# EAGLE board InkTime (EAGLE 9.7.0)
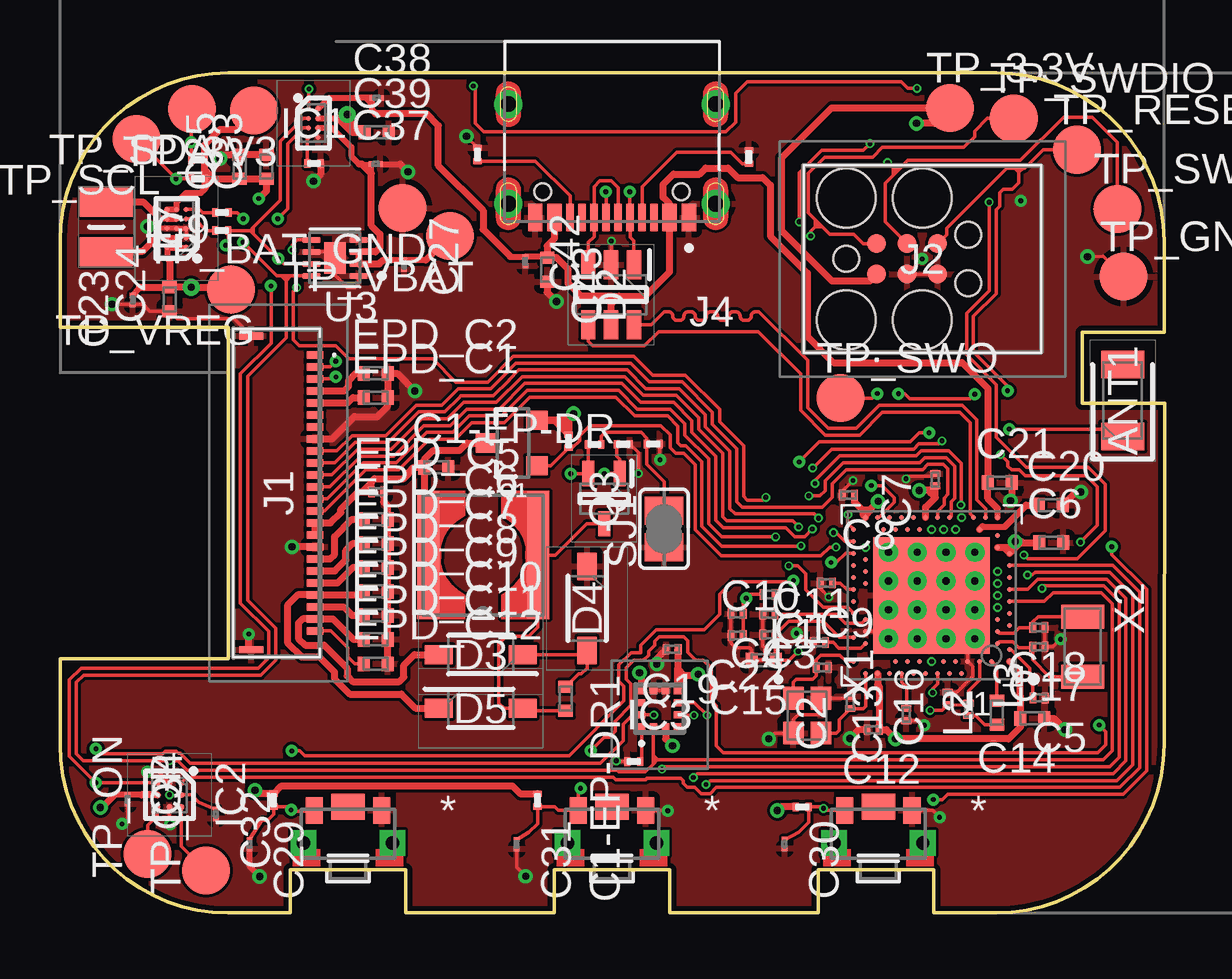
[diagram p1: board, top side]
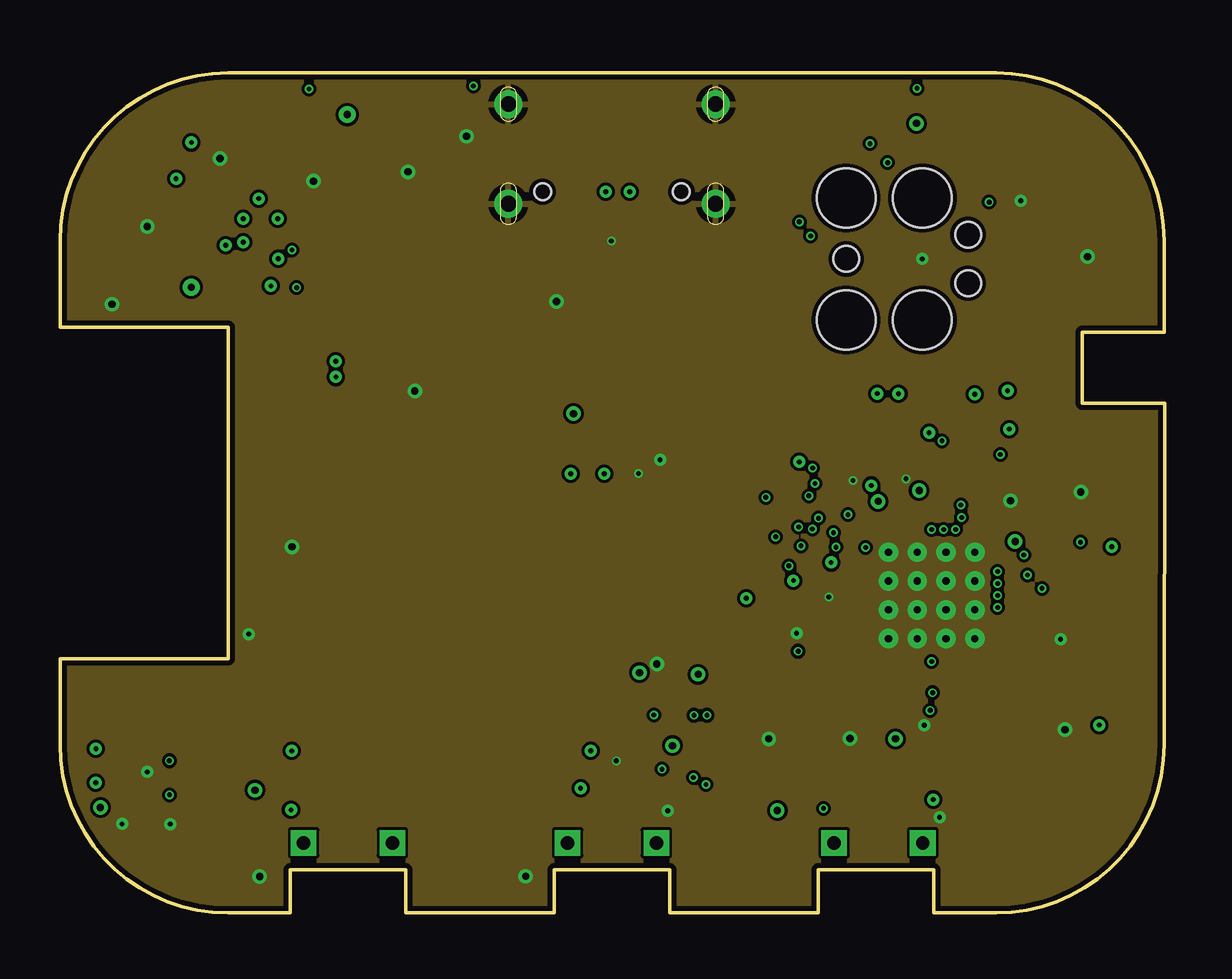
[diagram p2: board, inner layer Route2]
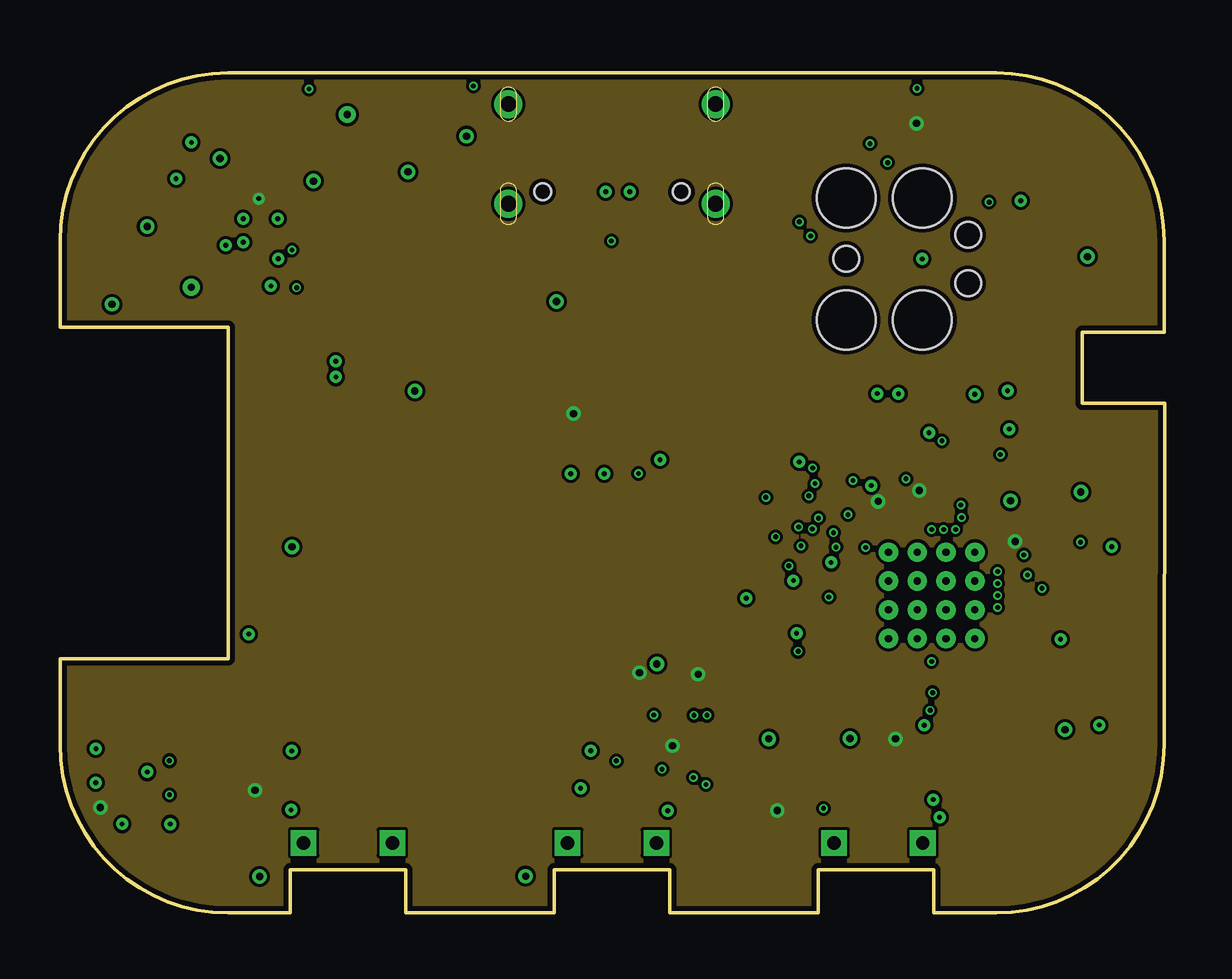
[diagram p3: board, inner layer Route15]
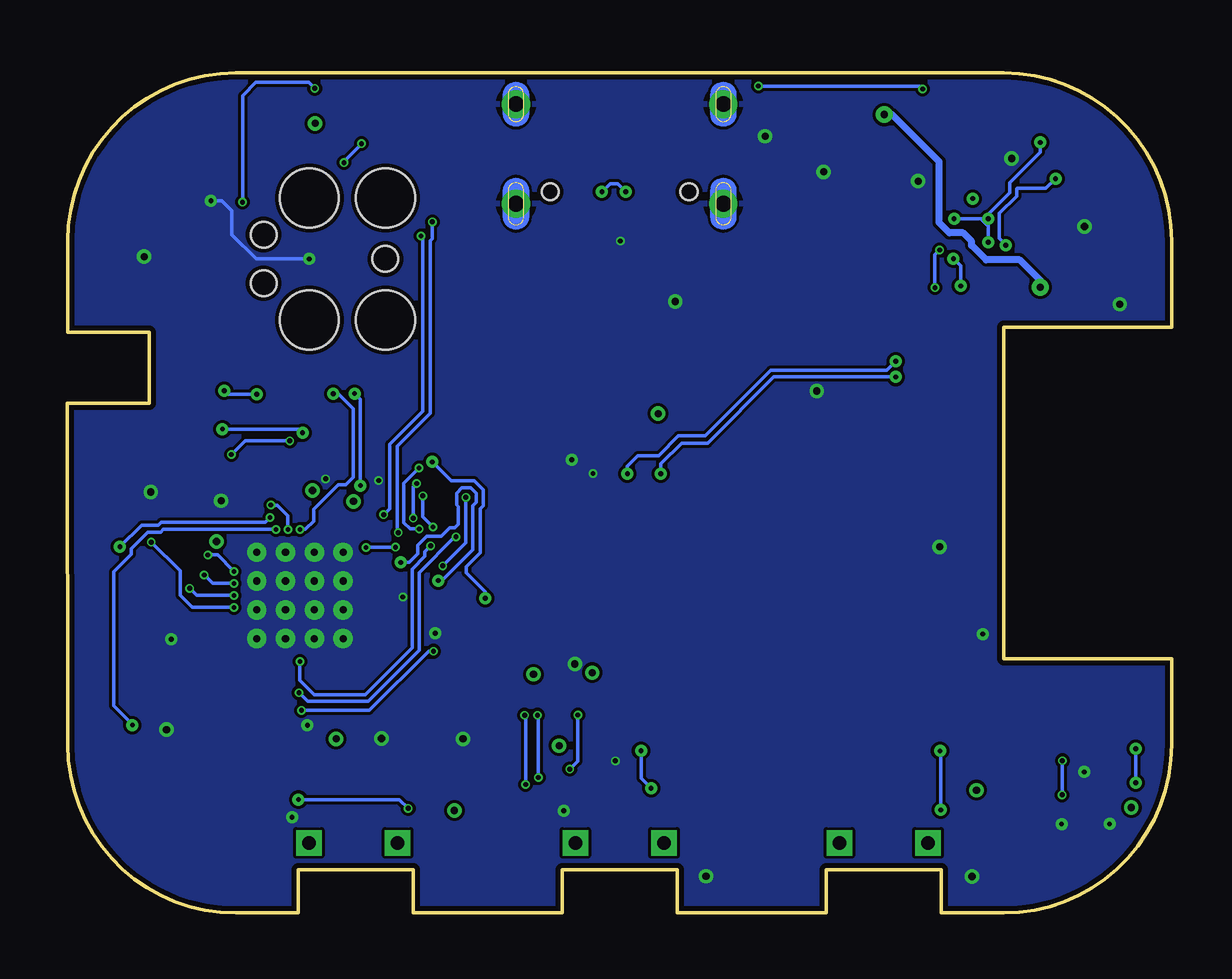
[diagram p4: board, bottom side, seen from below]

Size 46.02 x 35 mm. Coordinates in mm from the lower left corner, seen from the top.
Outline: 39,0 36.4,0 36.4,1.8 31.6,1.8 31.6,0 25.4,0 25.4,1.8 20.6,1.8 20.6,0 14.4,0 14.4,1.8 9.6,1.8 9.6,0 7,0 arc-90 0,7 0,10.6 7,10.6 7,24.4 0,24.4 0,28 arc-90 7,35 39,35 arc-90 46,28 46,24.19 42.59,24.19 42.59,21.24 46.02,21.24 46,7 arc-90 39,0
Copper layers (1+2*15+16): Top 0.035mm / dielectric 1.6mm / Route2 0.035mm / dielectric 0.15mm / Route15 0.035mm / dielectric 0.2mm / Bottom 0.035mm
Design rules "jlcpcb-2layers.dru *": minimum track width 5mil, minimum drill 0.2mm, track to track 5mil, track to pad 5mil, pad to pad 5mil, via to via 5mil, smd to smd 5mil, copper to edge 0.2mm, drill to drill 6mil, minimum pad ring 10mil, minimum via ring 3mil, stop-mask expansion 4mil, vias tented up to drill 999mm, thermal gap 10mil

## Footprints (pad centres in the part's own frame; a part is rotated, then mirrored left to right if it is on the bottom)
2450AT18B100E_ANTC3216X140N = smd 1.15 x 1.8: 1 -1.5,0; 2 1.5,0
NORDIC_NRF_3_RESC0201_L = smd 0.28 x 0.43: 1 -0.255,0; 2 0.255,0
NORDIC_NRF_3_RESC0402_L = smd 0.5 x 0.6: 1 -0.5,0; 2 0.5,0
GRM011R60J152KE01L_2_CAPC0201X13N = smd 0.22 x 0.23: 1 -0.185,0; 2 0.185,0
ESP32_C6_LIBRARY_3_SOT95P280X145-6N = smd 1.2 x 0.6: 1 -1.25,0.95; 2 -1.25,0; 3 -1.25,-0.95; 4 1.25,-0.95; 5 1.25,0; 6 1.25,0.95
ESP32_C6_LIBRARY_5_SOD3716X135N = smd 1.15 x 0.8: 1 -1.75,0; 2 1.75,0
BQ25180YBGR_BGA8C40P2X4_100X155X50 = smd 0.2 x 0.2: A1 -0.2,0.6; A2 0.2,0.6; B1 -0.2,0.2; B2 0.2,0.2; C1 -0.2,-0.2; C2 0.2,-0.2; D1 -0.2,-0.6; D2 0.2,-0.6
DRV2605YZFR_BGA9C50P3X3_144X144X62 = smd 0.25 x 0.25: A1 -0.5,0.5; A2 0,0.5; A3 0.5,0.5; B1 -0.5,0; B2 0,0; B3 0.5,0; C1 -0.5,-0.5; C2 0,-0.5; C3 0.5,-0.5
BMA423_BMA423 = smd 0.3 x 0.35: 1 -0.75,-0.775; 2 -0.25,-0.775; 3 0.25,-0.775; 4 0.75,-0.775; 7 0.75,0.775; 8 0.25,0.775; 9 -0.25,0.775; 10 -0.75,0.775 | smd 0.35 x 0.3: 5 0.775,-0.25; 6 0.775,0.25; 11 -0.775,0.25; 12 -0.775,-0.25
RT6160AWSC_BGA15C40P3X5_140X230X60 = smd 0.216 x 0.216: A1 -0.4,0.8; A2 0,0.8; A3 0.4,0.8; B1 -0.4,0.4; B2 0,0.4; B3 0.4,0.4; C1 -0.4,0; C2 0,0; C3 0.4,0; D1 -0.4,-0.4; D2 0,-0.4; D3 0.4,-0.4; E1 -0.4,-0.8; E2 0,-0.8; E3 0.4,-0.8
503480-2400_5034802400 = smd 0.3 x 0.7: 1 -5.75,1.525; 2 -5.25,1.525; 3 -4.75,1.525; 4 -4.25,1.525; 5 -3.75,1.525; 6 -3.25,1.525; 7 -2.75,1.525; 8 -2.25,1.525; 9 -1.75,1.525; 10 -1.25,1.525; 11 -0.75,1.525; 12 -0.25,1.525; 13 0.25,1.525; 14 0.75,1.525; 15 1.25,1.525; 16 1.75,1.525; 17 2.25,1.525; 18 2.75,1.525; 19 3.25,1.525; 20 3.75,1.525; 21 4.25,1.525; 22 4.75,1.525; 23 5.25,1.525; 24 5.75,1.525 | smd 0.3 x 1: MP1 -6.54,-1.125; MP2 6.54,-1.125
TC2030-IDC_TC2030IDC = smd 0.783 x 0.783: 1 -0.953,-0.635; 2 -0.953,0.635; 3 0.317,-0.635; 4 0.317,0.635; 5 1.588,-0.635; 6 1.588,0.635 | hole 2.451: -2.223,-2.54; -2.223,2.54; 0.952,-2.54; 0.952,2.54 | hole 1.067: -2.223,0; 2.857,-1.016; 2.857,1.016
KH-TYPE-C-16P_KINGHELM_KH-TYPE-C-16P = smd 0.6 x 1.15: A1_B12 -3.2,4.725; A4_B9 -2.4,4.725; A9_B4 2.4,4.725; A12_B1 3.2,4.725 | smd 0.3 x 1.15: A5 -1.25,4.725; A6 -0.25,4.725; A7 0.25,4.725; A8 1.25,4.725; B5 1.75,4.725; B6 0.75,4.725; B7 -0.75,4.725; B8 -1.75,4.725 | drill 0.65 pad 1.05: SH1 -4.32,0; SH2 4.32,0; SH3 -4.32,4.15; SH4 4.32,4.15 | hole 0.7: -2.89,3.65; 2.89,3.65
NORDIC_NRF_2_RESC0201_L = smd 0.28 x 0.43: 1 -0.255,0; 2 0.255,0
NORDIC_NRF_2_RESC0402_L = smd 0.5 x 0.6: 1 -0.5,0; 2 0.5,0
ESP32_C6_LIBRARY_2_IND_4828-WE-TPC_WRE = smd 0.9 x 5.3: 1 -2.286,0; 2 2.286,0
MLP2016SR47MT0S1_INDC2016X100N = smd 1.2 x 2.2: 1 -1.028,0; 2 1.028,0
ESP32_C6_LIBRARY_4_ESP32_C6_LIBRARY_4_ESP32_C6_LIBRARY_4_ESP32_C6_LIBRARY_4_ESP32_WROVER_SPARKFUN-DISCRETESEMI_SOT23-3 = smd 0.8 x 0.9: 1 -0.95,-1; 2 0.95,-1; 3 0,1.1
ESP32_C6_LIBRARY_6_SOT65P210X110-3N = smd 1.05 x 0.5: 1 -1.05,0.65; 2 -1.05,-0.65; 3 1.05,0
CPF0201D7K68C1_0201 = smd 0.35 x 0.25: 1 0,0.275; 2 0,-0.275
ERA-1AEB3401C_0201 = smd 0.35 x 0.25: 1 0,0.275; 2 0,-0.275
ESP32_C6_LIBRARY_7_JUMPER_SJ = smd 1.168 x 1.6: 1 -0.762,0; 2 0.762,0
2025-10-22_07-23-44_LIBRARY_SW_EVP-AKE31A_PAN = smd 0.711 x 1.092: 1 -1.4,-0.972; 2 1.4,-0.972 | drill 0.559 pad 0.914 square: 3 -1.848,0.381; 4 1.848,0.381 | smd 1.397 x 1.092: 5 0,-1.124
HECTOR_WATCH_1_TP20R = smd 2 x 2: TP 0,0
NORDIC_NRF_4_AQFN50P700X700X85_HS-74N = smd 4.85 x 4.85: P$74 0,0 | drill 0.3 pad 0.6: P$75 -1.8,1.8; P$76 -0.6,1.8; P$77 0.6,1.8; P$78 1.8,1.8; P$79 -1.8,0.6; P$80 -0.6,0.6; P$81 0.6,0.6; P$82 1.8,0.6; P$83 -1.8,-0.6; P$84 -0.6,-0.6; P$85 0.6,-0.6; P$86 1.8,-0.6; P$87 -1.8,-1.8; P$88 -0.6,-1.8; P$89 0.6,-1.8; P$90 1.8,-1.8 | smd 0.2 x 0.2: P$A8 -1.25,3.25; P$A10 -0.75,3.25; P$A12 -0.25,3.25; P$A14 0.25,3.25; P$A16 0.75,3.25; P$A18 1.25,3.25; P$A20 1.75,3.25; P$A22 2.25,3.25; P$A23 2.75,3.25; P$AA24 3.25,-2.25; P$AB2 -2.75,-2.5; P$AC5 -2,-2.75; P$AC9 -1,-2.75; P$AC11 -0.5,-2.75; P$AC13 0,-2.75; P$AC15 0.5,-2.75; P$AC17 1,-2.75; P$AC19 1.5,-2.75; P$AC21 2,-2.75; P$AC24 3.25,-2.75; P$AD2 -2.75,-3.25; P$AD4 -2.25,-3.25; P$AD6 -1.75,-3.25; P$AD8 -1.25,-3.25; P$AD10 -0.75,-3.25; P$AD12 -0.25,-3.25; P$AD14 0.25,-3.25; P$AD16 0.75,-3.25; P$AD18 1.25,-3.25; P$AD20 1.75,-3.25; P$AD22 2.25,-3.25; P$AD23 2.75,-3.25; P$B1 -3.25,2.75; P$B3 -2.5,2.75; P$B5 -2,2.75; P$B7 -1.5,2.75; P$B9 -1,2.75; P$B11 -0.5,2.75; P$B13 0,2.75; P$B15 0.5,2.75; P$B17 1,2.75; P$B19 1.5,2.75; P$B24 3.25,2.75; P$C1 -3.25,2.25; P$D2 -2.75,2; P$D23 2.75,2; P$E24 3.25,1.75; P$F2 -2.75,1.5; P$F23 2.75,1.5; P$G1 -3.25,1.25; P$H2 -2.75,1; P$H23 2.75,1; P$J1 -3.25,0.75; P$J24 3.25,0.75; P$K2 -2.75,0.5; P$L1 -3.25,0.25; P$L24 3.25,0.25; P$M2 -2.75,0; P$N1 -3.25,-0.25; P$N24 3.25,-0.25; P$P2 -2.75,-0.5; P$P23 2.75,-0.5; P$R1 -3.25,-0.75; P$R24 3.25,-0.75; P$T2 -2.75,-1; P$T23 2.75,-1; P$U1 -3.25,-1.25; P$U24 3.25,-1.25; P$V23 2.75,-1.5; P$W1 -3.25,-1.75; P$W24 3.25,-1.75; P$Y2 -2.75,-2; P$Y23 2.75,-2
ESP32_C6_LIBRARY_SON50P200X200X80-9N = smd 0.76 x 0.27: 1 -0.985,0.75; 2 -0.985,0.25; 3 -0.985,-0.25; 4 -0.985,-0.75; 5 0.985,-0.75; 6 0.985,-0.25; 7 0.985,0.25; 8 0.985,0.75 | smd 0.9 x 1.3: 9 0,0
NORDIC_NRF_BT-XTAL_2016_N = smd 0.95 x 0.85: 1 -0.725,-0.575; 2 0.725,-0.575; 3 0.725,0.575; 4 -0.725,0.575
NORDIC_NRF_1_XTAL_3215_N = smd 1 x 1.8: 1 -1.25,0; 2 1.25,0

## Placement (x,y rotation side)
ANT1  2450AT18B100E  [2450AT18B100E_ANTC3216X140N]  44.28,21.35 90 top
C1  12pF  [NORDIC_NRF_3_RESC0201_L]  31.77,10.23 0 top
C1-EP-DR  10uF  [NORDIC_NRF_3_RESC0402_L]  15.68,18.56 0 top
C1-EP-DR1  10uF  [NORDIC_NRF_3_RESC0402_L]  21.07,8.92 270 top
C2  12pF  [NORDIC_NRF_3_RESC0201_L]  32.93,8.77 90 top
C3  1pF  [NORDIC_NRF_3_RESC0201_L]  29.54,12.45 180 top
C4  1pF  [NORDIC_NRF_3_RESC0201_L]  28.21,12.46 180 top
C5  100nF  [NORDIC_NRF_3_RESC0201_L]  40.8,8.96 180 top
C6  4.7uF  [NORDIC_NRF_3_RESC0402_L]  41.3,15.43 0 top
C7  100nF  [NORDIC_NRF_3_RESC0201_L]  36.47,18.05 90 top
C8  100nF  [NORDIC_NRF_3_RESC0201_L]  32.85,17.41 180 top
C9  820pF  [NORDIC_NRF_3_RESC0201_L]  31.93,13.75 180 top
C10  N.C.  [NORDIC_NRF_3_RESC0201_L]  29.54,11.59 0 top
C11  100pF  [NORDIC_NRF_3_RESC0201_L]  31.64,11.27 0 top
C12  100nF  [NORDIC_NRF_3_RESC0201_L]  33.88,7.63 180 top
C13  N.C.  [NORDIC_NRF_3_RESC0201_L]  35.26,8.26 90 top
C14  4.7uF  [NORDIC_NRF_3_RESC0402_L]  40.51,8.1 180 top
C15  1uF  [NORDIC_NRF_3_RESC0402_L]  29.33,10.53 180 top
C16  47nF  [NORDIC_NRF_3_RESC0201_L]  36.99,8.94 90 top
C17  12pF  [NORDIC_NRF_3_RESC0201_L]  40.78,11.09 180 top
C18  12pF  [NORDIC_NRF_3_RESC0201_L]  40.79,11.89 180 top
C19  100nF  [NORDIC_NRF_3_RESC0201_L]  25.51,10.99 180 top
C20  4.7uF  [NORDIC_NRF_3_RESC0402_L]  41.28,16.99 0 top
C21  4.7uF  [NORDIC_NRF_3_RESC0402_L]  39.16,17.93 0 top
C22  N.C.  [NORDIC_NRF_3_RESC0201_L]  28.21,11.56 180 top
C23  0.1uF  [GRM011R60J152KE01L_2_CAPC0201X13N]  3.03,25.54 90 top
C24  10uF  [NORDIC_NRF_3_RESC0402_L]  4.57,25.58 90 top
C25  22uF  [NORDIC_NRF_3_RESC0402_L]  7.48,31.09 90 top
C27  0.1uF  [GRM011R60J152KE01L_2_CAPC0201X13N]  14.34,27 270 top
C29  1uF  [GRM011R60J152KE01L_2_CAPC0201X13N]  7.89,2.86 270 top
C30  1uF  [GRM011R60J152KE01L_2_CAPC0201X13N]  30.19,2.87 270 top
C31  1uF  [GRM011R60J152KE01L_2_CAPC0201X13N]  19.03,2.86 270 top
C32  1uF  [GRM011R60J152KE01L_2_CAPC0201X13N]  6.5,4.12 270 top
C33  22uF  [NORDIC_NRF_3_RESC0402_L]  8.6,31.1 90 top
C34  0.1uF  [GRM011R60J152KE01L_2_CAPC0201X13N]  2.82,4.74 270 top
C37  1uF  [GRM011R60J152KE01L_2_CAPC0201X13N]  13.16,31.2 0 top
C38  1uF  [GRM011R60J152KE01L_2_CAPC0201X13N]  13.2,33.96 0 top
C39  10uF  [NORDIC_NRF_3_RESC0402_L]  13.2,32.53 0 top
C42  0.1uF  [GRM011R60J152KE01L_2_CAPC0201X13N]  19.39,27.16 270 top
C43  4.7uF  [NORDIC_NRF_3_RESC0402_L]  20.3,26.8 270 top
D2  USBLC6-2SC6Y  [ESP32_C6_LIBRARY_3_SOT95P280X145-6N]  22.96,25.76 270 top
D3  MBR0530  [ESP32_C6_LIBRARY_5_SOD3716X135N]  17.53,10.76 180 top
D4  MBR0530  [ESP32_C6_LIBRARY_5_SOD3716X135N]  21.96,12.69 270 top
D5  MBR0530  [ESP32_C6_LIBRARY_5_SOD3716X135N]  17.53,8.53 0 top
EPD_C1  1uF/50V  [NORDIC_NRF_3_RESC0402_L]  13.15,21.47 0 top
EPD_C2  1uF/50V  [NORDIC_NRF_3_RESC0402_L]  13.15,22.48 0 top
EPD_C5  0.1uF/50V  [NORDIC_NRF_3_RESC0201_L]  13.23,17.54 0 top
EPD_C6  1uF/50V  [NORDIC_NRF_3_RESC0402_L]  13.15,16.4 0 top
EPD_C7  1uF/50V  [NORDIC_NRF_3_RESC0402_L]  13.15,15.4 0 top
EPD_C8  1uF/50V  [NORDIC_NRF_3_RESC0402_L]  13.15,14.4 0 top
EPD_C9  1uF/50V  [NORDIC_NRF_3_RESC0402_L]  13.15,13.4 0 top
EPD_C10  1uF/50V  [NORDIC_NRF_3_RESC0402_L]  13.15,12.4 0 top
EPD_C11  1uF/50V  [NORDIC_NRF_3_RESC0402_L]  13.15,11.4 0 top
EPD_C12  1uF/50V  [NORDIC_NRF_3_RESC0402_L]  13.15,10.38 0 top
IC1  BQ25180YBGR  [BQ25180YBGR_BGA8C40P2X4_100X155X50]  10.56,32.91 0 top
IC2  DRV2605YZFR  [DRV2605YZFR_BGA9C50P3X3_144X144X62]  4.56,4.92 270 top
IC3  BMA423  [BMA423_BMA423]  24.98,8.51 0 top
IC9  RT6160AWSC  [RT6160AWSC_BGA15C40P3X5_140X230X60]  4.86,28.52 180 top
J1  503480-2400  [503480-2400_5034802400]  9.1,17.5 270 top
J2  TC2030-IDC  [TC2030-IDC_TC2030IDC]  34.98,27.25 0 top
J4  KH-TYPE-C-16P  [KH-TYPE-C-16P_KINGHELM_KH-TYPE-C-16P]  23,33.7 180 top
L1  3.9nH  [NORDIC_NRF_2_RESC0201_L]  29.55,13.27 180 top
L2  10uH  [NORDIC_NRF_2_RESC0402_L]  39.04,8.34 90 top
L3  15nH  [NORDIC_NRF_2_RESC0201_L]  37.86,8.48 270 top
L4  68uH  [ESP32_C6_LIBRARY_2_IND_4828-WE-TPC_WRE]  17.63,14.91 180 top
L7  FTC252012SR47MBCA  [MLP2016SR47MT0S1_INDC2016X100N]  1.93,28.58 90 top
Q1  20V/4.2A/52mΩ/1.4W  [ESP32_C6_LIBRARY_4_ESP32_C6_LIBRARY_4_ESP32_C6_LIBRARY_4_ESP32_C6_LIBRARY_4_ESP32_WROVER_SPARKFUN-DISCRETESEMI_SOT23-3]  18.87,19.58 90 top
Q3  SI1308EDL-T1-GE3  [ESP32_C6_LIBRARY_6_SOT65P210X110-3N]  22.67,17.26 270 top
R1_EP_DR  0.47  [CPF0201D7K68C1_0201]  22.27,19.52 270 top
R1_USB  5K1  [ERA-1AEB3401C_0201]  28.7,31.5 0 top
R2  0  [CPF0201D7K68C1_0201]  6.75,29.18 270 top
R2_EP_DR  10K  [CPF0201D7K68C1_0201]  23.47,19.53 270 top
R2_USB  5K1  [ERA-1AEB3401C_0201]  17.4,31.6 180 top
R3  0  [CPF0201D7K68C1_0201]  23.9,6.31 90 top
R4  0  [CPF0201D7K68C1_0201]  6.74,28.43 270 top
R5  10K  [CPF0201D7K68C1_0201]  30.93,4.42 270 top
R7  10K  [CPF0201D7K68C1_0201]  8.9,4.7 180 top
R8  10K  [CPF0201D7K68C1_0201]  19.9,4.7 180 top
R9  10K  [CPF0201D7K68C1_0201]  10.58,31.23 270 top
R17  3K3  [CPF0201D7K68C1_0201]  5.75,30.59 270 top
R18  3K3  [CPF0201D7K68C1_0201]  5.75,31.38 270 top
R_PWR_EPD  10K  [CPF0201D7K68C1_0201]  21.19,19.65 180 top
R_TYPE_SEL  2.2  [CPF0201D7K68C1_0201]  24.72,19.54 270 top
SJ1  JUMPER_SJ  [ESP32_C6_LIBRARY_7_JUMPER_SJ]  25.17,16 90 top
SW_DN  2025-10-22_07-23-44_LIBRARY_EVP-AKE31ASW_EVP-AKE31A_PAN  [2025-10-22_07-23-44_LIBRARY_SW_EVP-AKE31A_PAN]  12,3.3 180 top
SW_ENT  2025-10-22_07-23-44_LIBRARY_EVP-AKE31ASW_EVP-AKE31A_PAN  [2025-10-22_07-23-44_LIBRARY_SW_EVP-AKE31A_PAN]  23,3.3 180 top
SW_UP  2025-10-22_07-23-44_LIBRARY_EVP-AKE31ASW_EVP-AKE31A_PAN  [2025-10-22_07-23-44_LIBRARY_SW_EVP-AKE31A_PAN]  34.1,3.3 180 top
TP_3.3V  HECTOR_WATCH_1_TPTP20R  [HECTOR_WATCH_1_TP20R]  37.08,33.54 0 top
TP_3V3  HECTOR_WATCH_1_TPTP20R  [HECTOR_WATCH_1_TP20R]  8.09,33.43 180 top
TP_BAT_GND  HECTOR_WATCH_1_TPTP20R  [HECTOR_WATCH_1_TP20R]  14.28,29.37 180 top
TP_GND  HECTOR_WATCH_1_TPTP20R  [HECTOR_WATCH_1_TP20R]  44.32,26.51 0 top
TP_ON  HECTOR_WATCH_1_TPTP20R  [HECTOR_WATCH_1_TP20R]  3.65,2.46 90 top
TP_OP  HECTOR_WATCH_1_TPTP20R  [HECTOR_WATCH_1_TP20R]  6.08,1.76 90 top
TP_RESET\  HECTOR_WATCH_1_TPTP20R  [HECTOR_WATCH_1_TP20R]  42.38,31.8 0 top
TP_SCL  HECTOR_WATCH_1_TPTP20R  [HECTOR_WATCH_1_TP20R]  3.18,32.24 180 top
TP_SDA  HECTOR_WATCH_1_TPTP20R  [HECTOR_WATCH_1_TP20R]  5.51,33.5 180 top
TP_SWDCLK  HECTOR_WATCH_1_TPTP20R  [HECTOR_WATCH_1_TP20R]  44.06,29.33 0 top
TP_SWDIO  HECTOR_WATCH_1_TPTP20R  [HECTOR_WATCH_1_TP20R]  39.74,33.11 0 top
TP_SWO  HECTOR_WATCH_1_TPTP20R  [HECTOR_WATCH_1_TP20R]  32.52,21.45 0 top
TP_VBAT  HECTOR_WATCH_1_TPTP20R  [HECTOR_WATCH_1_TP20R]  16.25,28.2 180 top
TP_VREG  HECTOR_WATCH_1_TPTP20R  [HECTOR_WATCH_1_TP20R]  7.12,25.98 180 top
U1  NRF52840_QF  [NORDIC_NRF_4_AQFN50P700X700X85_HS-74N]  36.32,13.23 180 top
U3  MAX17048G+T10  [ESP32_C6_LIBRARY_SON50P200X200X80-9N]  11.46,27.29 180 top
X1  32MHz  [NORDIC_NRF_BT-XTAL_2016_N]  31.13,8.22 270 top
X2  32.768kHz  [NORDIC_NRF_1_XTAL_3215_N]  42.62,11.1 270 top

## Tracks (layer width: path | path; a pad name or v marks a point on that pad's centre or on a via)
3V3  (via drill 0.2 pad 0.5, 0.3 pad 0.6)
  Top 0.254: IC9.E3 IC9.E2 4.86,29.62 5.24,30 5.87,30 6.02,30.16 R17.1 | C34.1 2.28,4.92 | 3.39,4.92 C34.1 | C34.1
  Top 0.3: 6.39,30.59 R17.1 6.02,30.97 | 6.39,30.59 C25.1 8.59,30.59 C33.1 8.6,30.08 v8.29,29.77 | 6.02,30.97 R18.1 6.02,32.01 6.67,32.65 7.35,32.65 8.09,33.38 TP_3V3.TP | 20.87,20.25 20.59,20.53 Q1.2 21.12,20.53 | 20.87,20.25 R_PWR_EPD.2 21.19,20.46 21.12,20.53 | J2.1 33.74,26.33 32.18,26.33 30.07,28.43 30.07,31.47 32.15,33.54 TP_3.3V.TP 36.44,32.9 v35.69,32.9 | U1.P$B1 40,10.05 C14.2 40.01,7.74 39.53,7.26 v34.81,7.26 34.44,7.63 C12.1 34.13,9.45 34.07,9.51 U1.P$A22 | 39.82,15.23 U1.P$W1 39.32,15.23 | 39.82,15.23 40.02,15.43 | 40.02,15.43 40.06,15.47 v39.8,15.47 39.55,15.23 | 40.02,15.43 C6.1 | U1.P$Y2 39.32,15.23 | 39.32,15.23 39.55,15.23 | 39.55,15.23 39.82,15.23 | U1.P$AD14 36.07,16.91 36.47,17.31 | 36.47,17.31 C7.1 36.28,17.61 | 33.45,16.77 33.1,17.12 C8.1 | IC3.7 25.73,9.54 | 25.73,9.54 25.73,9.89 | 25.73,9.89 25.73,10.18 | 25.73,10.18 25.73,10.96 C19.1 | 21.12,20.53 v21.39,20.8 | 20.87,20.25 21.12,20.51 21.12,20.53 | R8.2 19.17,4.97 18.85,5.29 9.22,5.29 R7.2 8.27,4.97 v8.13,5.11 | R5.2 30.04,4.42 v29.89,4.27 | 36.28,17.61 v35.8,17.61 | 36.28,17.61 36.28,17.5 36.47,17.31 | v34.09,17.15 33.71,16.77 | 33.45,16.77 33.45,16.6 | 33.45,16.6 U1.P$AD23 | 33.45,16.6 33.6,16.6 33.77,16.77 33.71,16.77 | 33.71,16.77 33.45,16.77 | v26.59,9.94 26.54,9.89 26.08,9.89 | 26.02,9.89 25.73,9.89 | 25.73,10.18 26.02,9.89 | 26.02,9.89 26.08,9.89 | 26.08,9.89 25.73,9.54 | IC3.10 24.23,9.92 v24.14,10.01 | 6.39,30.59 6.02,30.23 6.02,30.16 | 6.39,30.59 6.39,30.61 6.02,30.97 | IC2.C2 3.39,4.92 | 2.28,4.92 1.76,4.39 v1.68,4.39 | IC3.3 25.23,7.26 v25.52,6.97
  pour Route15: 206 corners
ALERT  (via drill 0.2)
  Top 0.15: U1.P$J24 32.82,12.73 31.8,12.73 31.08,13.46 31.08,14.13 30.75,14.46 v30.37,14.46 | v29.41,17.31 29.29,17.2 28.64,17.2 28.49,17.35 28.49,19.46 27.48,20.47 27.48,20.98 26.06,22.4 24.7,22.4 24.51,22.59 | 24.51,22.59 | 24.51,22.59 23.9,23.19 18.89,23.19 17.82,22.12 16.5,22.12 15.53,23.09 12.04,23.09 11.49,23.64 9.97,23.64 9.72,23.88 9.72,25.91 v9.86,26.05 | v9.67,27.62 9.67,27.82 9.88,28.04 U3.5
  Bottom 0.15: v30.37,14.46 29.41,15.42 v29.41,17.31 | v9.86,26.05 9.86,27.43 v9.67,27.62
D+
  Top 0.15: D2.4 22.01,23.82 22.2,23.63 24.35,23.63 24.95,24.23 29.1,24.23 30.86,22.47 30.86,20.94 31.89,19.91 33.32,19.91 34.26,20.86 37.48,20.86 37.92,20.42 37.92,16.62 U1.P$AD6
D-
  Top 0.15: D2.6 24.63,24.51 25.17,25.05 25.35,25.05 arc-90 25.53,24.87 arc90 25.71,24.69 25.82,24.69 arc90 26,24.87 arc-90 26.18,25.05 26.29,25.05 arc-90 26.47,24.87 arc90 26.64,24.69 26.75,24.69 arc90 26.93,24.87 arc-90 27.11,25.05 27.22,25.05 arc-90 27.4,24.87 arc90 27.58,24.69 27.69,24.69 arc90 27.87,24.87 arc-90 28.05,25.05 28.16,25.05 arc-90 28.34,24.87 arc90 28.52,24.69 28.62,24.69 arc90 28.8,24.87 arc-90 28.98,25.05 29.12,25.05 31.15,23.02 31.15,21.05 32.01,20.19 33.19,20.19 34.14,21.15 37.59,21.15 38.2,20.54 38.2,17.21 38.57,16.84 U1.P$AD4
DN  (via drill 0.2 pad 0.5)
  Top 0.15: D2.1 23.91,28 23.75,28.16 J4.B7 23.74,28.99 v23.74,30.05 | J4.A7 v22.75,30.04 v22.74,30.05
  Bottom 0.15: v22.74,30.05 23.08,30.39 23.4,30.39 v23.74,30.05
DP
  Top 0.15: D2.3 22.01,27.94 22.25,28.18 J4.B6 22.25,30.26 22.5,30.51 22.96,30.51 23.25,30.22 J4.A6
EPD_3V3
  Top 0.3: J1.16 J1.15 11.27,16.25 11.7,16.68 11.7,16.83 12.42,17.55 12.6,17.55 | 12.6,17.55 EPD_C5.1 12.98,17.92 | C1-EP-DR.1 14.73,18.56 14.52,18.36 14.52,18.29 14.33,18.1 13.11,18.1 12.97,17.96 12.98,17.96 12.98,17.92 | C1-EP-DR.1 15.18,15.07 L4.2 | C1-EP-DR.1 15.18,18.9 15.55,19.27 16.65,19.27 16.96,19.58 Q1.3 | 12.6,17.55 12.98,17.92
EPD_BUSY
  Top 0.15: J1.9 11.53,19.25 12.17,19.89 13.56,19.89 14.84,21.16 15.91,21.16 16.59,21.84 17.94,21.84 18.61,22.51 18.61,22.52 19,22.91 23.77,22.91 24.55,22.12 25.92,22.12 27.18,20.87 27.18,20.37 28.2,19.35 28.2,17.13 28.42,16.91 31.75,16.91 32.17,17.32 32.17,17.88 32.76,18.47 35.95,18.47 36.16,18.69 36.81,18.69 36.99,18.5 36.99,17.44 36.84,17.28 36.84,17 36.57,16.74 U1.P$AD12
EPD_CS  (via drill 0.2)
  Top 0.15: J1.12 11.24,17.75 12.53,19.04 13.9,19.04 15.16,20.3 16.26,20.3 16.93,20.97 16.95,20.99 18.3,20.99 19.37,22.06 23.4,22.06 24.19,21.27 25.56,21.27 26.32,20.51 26.32,20.03 27.33,19.03 27.33,16.35 27.63,16.05 30.24,16.05 30.62,15.68 31.02,15.68 v31.35,16 | v31.36,18.54 32.15,19.32 35.56,19.32 35.78,19.54 36.62,19.54 v36.75,19.67 | v39.18,19.1 39.49,18.79 39.49,18.61 39.65,18.46 39.98,18.46 40.21,18.22 42.77,18.22 43.23,17.76 43.23,16.16 v42.52,15.45
  Bottom 0.15: v31.35,16 31.73,16 31.99,16.26 31.99,17.91 v31.36,18.54 | v39.18,19.1 38.61,19.67 v36.75,19.67 | v42.52,15.45 41.32,14.25 41.32,13.24 40.81,12.73 U1.P$K2
  other vias: 39.07,12.73
EPD_DC  (via drill 0.2)
  Top 0.15: J1.11 11.33,18.25 12.41,19.32 13.79,19.32 15.01,20.54 | 15.01,20.54 | 15.01,20.54 15.06,20.59 16.14,20.59 16.83,21.27 18.18,21.27 19.25,22.34 23.52,22.34 24.3,21.56 25.67,21.56 26.61,20.63 26.61,20.15 27.61,19.15 27.61,16.5 27.78,16.33 30.53,16.33 v30.78,16.09 | v31.2,17.38 31.66,17.38 31.88,17.6 31.88,18.02 32.63,18.76 35.83,18.76 36.03,18.97 36.92,18.97 37.28,18.61 37.28,17.28 37.12,17.12 37.12,16.54 U1.P$AD10
  Bottom 0.15: v30.78,16.09 31.2,16.51 v31.2,17.38
EPD_RST  (via drill 0.2)
  Top 0.15: J1.10 11.44,18.75 12.3,19.61 13.69,19.61 14.95,20.88 16.02,20.88 16.03,20.87 16.63,21.47 | 16.63,21.47 | 16.63,21.47 16.7,21.55 18.05,21.55 18.71,22.2 18.71,22.21 19.12,22.62 23.64,22.62 24.42,21.84 25.81,21.84 26.89,20.76 26.89,20.26 27.91,19.24 27.91,16.84 28.13,16.62 31.43,16.62 v31.6,16.45 | v31.46,17.89 31.46,18.02 32.48,19.04 35.68,19.04 35.89,19.25 37.04,19.25 37.56,18.73 37.56,17.02 v37.53,17
  Bottom 0.15: v31.6,16.45 31.6,17.75 v31.46,17.89 | U1.P$AC11 36.82,16.54 37.27,17 v37.53,17
  other vias: 36.82,15.98
GDR  (via drill 0.2 pad 0.5)
  Top 0.15: R2_EP_DR.2 23.2,19.02 23.32,18.9 Q3.1 v22.68,18.31 v22.68,18.3 | J1.2 11.26,22.75 v11.49,22.98
  Bottom 0.15: v11.49,22.98 11.87,22.61 16.7,22.61 19.43,19.88 20.55,19.88 21.38,19.05 22.25,19.05 22.68,18.62 v22.68,18.3
GND  (via drill 0.2, 0.2 pad 0.5, 0.3 pad 0.6, 0.3 pad 0.61)
  Top 0.15: J2.5 J2.3 v35.93,27.25 | IC9.C3 IC9.C2 | IC3.9 IC3.8 | TP_GND.TP 43.48,27.35 v42.81,27.35 | U1.P$75 37.82,11.13 U1.P$B7 38.03,10.27 38.03,9.85 37.37,9.19 C16.2 | U1.P$F23 34.22,11.73 U1.P$78 | J1.MP1 7.26,24.76 4.89,24.76 C24.1 3.75,25.07 3.47,25.36 C23.1 3.02,25.36 v2.16,25.36 | C18.1 C17.1 41.38,11.09 v41.69,11.41 | R3.1 23.21,6.31 v23.18,6.34 | C8.2 32.59,17.57 v33.04,18.02 | R2_USB.2 16.94,32.34 v16.94,32.36 | C3.2 C10.1 29.28,11.12 29.36,11.04 29.36,10.65 29.25,10.53 C15.2 28.82,10.97 28.75,11.05 28.16,11.05 27.95,11.25 C22.2 C4.2 | U3.6 11.21,27.54 U3.9 11.46,26.56 11.97,26.05 12.28,26.05 12.45,26.22 U3.1 | C2.2 32.85,8.95 X1.4 31.71,8.35 31.61,8.25 30.75,8.25 30.56,8.06 X1.2 29.77,7.49 v29.53,7.25 | R_TYPE_SEL.1 v25,18.89 | C34.2 2.82,3.94 v2.59,3.71 | IC2.B3 4.56,3.73 v4.59,3.7 | SW_ENT.1 25.32,4.27 v25.33,4.26 | C13.1 35.83,8.01 v36.01,7.82 | SW_UP.1 36.37,4.27 v36.65,3.99 | IC9.B1 IC9.C1 | R2_EP_DR.1 24.11,19.17 v24.11,18.31 | C11.1 31.07,11.27 v30.69,11.66 | C9.2 31.68,13.52 v32.04,13.16 | D2.2 22.96,27.98 v22.97,27.99 | C31.2 19.03,1.9 v19.4,1.53 | IC2.B1 4.11,5.87 v3.64,5.87 | C7.2 36.36,18.19 35.35,18.19 v35.25,18.09
  Top 0.2: v3.63,28.6 3.71,28.52 IC9.C3 IC9.C2 IC9.C1
  Top 0.254: C37.2 14.18,31.2 | C29.2 7.89,1.95 v8.32,1.52
  Top 0.3: v14.79,21.74 14.05,22.48 EPD_C2.2 EPD_C1.2 13.65,21.11 13.22,20.68 12.27,20.68 11.34,19.75 J1.8 | EPD_C12.2 EPD_C11.2 EPD_C10.2 EPD_C9.2 EPD_C8.2 EPD_C7.2 EPD_C6.2 13.65,16.95 13.49,17.11 EPD_C5.2 | J1.17 v9.67,15.25 v9.66,15.25 | C21.2 39.66,17.23 v39.6,17.17 | 14.18,31.2 v14.5,30.88 | J1.MP2 7.87,11.07 v7.87,11.62 | C12.2 33.29,7.63 v32.92,7.26 | C14.1 41.41,8.1 v41.88,7.64 | C20.2 42.33,17.54 v42.54,17.54 | C43.2 20.3,25.86 v20.69,25.48 | R9.1 10.86,30.78 v10.56,30.49 | v6.67,31.44 v6.68,31.44 6.82,31.58 7.07,31.58 7.08,31.59 C25.2 8.59,31.59 C33.2 | C19.2 24.87,10.6 v24.87,10.38 | U1.P$74 U1.P$85
  Bottom 0.15: v35.93,27.25 38.15,27.25 39.15,28.25 39.15,29.26 39.58,29.68 v40.03,29.68
  pour Top: 279 corners
  pour Bottom: 9.59,1.92 9.62,1.92 14.44,1.92 14.48,1.9 14.52,1.86 14.54,1.81 14.54,0.13 20.5,0.13 20.52,1.77 20.52,1.79 20.52,1.79 20.52,1.8 20.53,1.82 20.53,1.84 20.54,1.84 20.54,1.84 20.55,1.86 20.57,1.88 20.57,1.88 20.57,1.88 20.59,1.89 20.62,1.9 20.62,1.9 20.62,1.9 20.64,1.9 25.38,1.94 25.4,1.94 25.4,1.94 25.4,1.94 25.43,1.93 25.45,1.92 25.45,1.92 25.45,1.92 25.47,1.9 25.49,1.88 25.49,1.88 25.49,1.88 25.5,1.86 25.51,1.84 25.51,1.84 25.51,1.83 25.51,1.81 25.54,0.15 31.45,0.09 31.52,1.79 31.52,1.82 31.53,1.82 31.53,1.82 31.54,1.84 31.54,1.86 31.55,1.86 31.55,1.87 31.56,1.88 31.58,1.9 31.58,1.9 31.58,1.9 31.61,1.91 31.63,1.92 31.63,1.92 31.63,1.92 31.65,1.92 36.41,1.86 36.43,1.86 36.43,1.86 36.43,1.86 36.46,1.85 36.48,1.84 36.48,1.84 36.48,1.84 36.5,1.82 36.52,1.8 36.52,1.8 36.52,1.8 36.53,1.78 36.53,1.76 36.53,1.75 36.54,1.75 36.53,1.73 36.53,0.13 39.04,0.13 39.8,0.19 40.55,0.33 41.28,0.54 41.98,0.83 42.65,1.19 43.27,1.62 43.85,2.11 44.38,2.67 44.83,3.28 45.21,3.95 45.52,4.65 45.73,5.38 45.87,6.13 45.91,6.9 45.89,28.12 45.78,28.98 45.58,29.82 45.29,30.63 44.91,31.4 44.44,32.13 43.9,32.8 43.37,33.33 42.78,33.79 42.14,34.17 41.46,34.48 40.74,34.7 40.01,34.83 39.26,34.88 6.93,34.9 5.93,34.77 4.96,34.53 4.01,34.18 3.12,33.73 2.28,33.18 1.8,32.79 1.38,32.35 1.01,31.86 0.71,31.33 0.46,30.76 0.29,30.18 0.18,29.57 0.15,28.96 0.17,24.62 7,24.53 7.02,24.53 7.02,24.53 7.02,24.53 7.04,24.52 7.07,24.51 7.07,24.51 7.07,24.51 7.08,24.49 7.1,24.47 7.1,24.47 7.1,24.47 7.11,24.45 7.12,24.43 7.12,24.42 7.12,24.42 7.12,24.4 7.16,10.63 7.16,10.63 7.16,10.61 7.16,10.58 7.16,10.58 7.16,10.58 7.15,10.56 7.14,10.54 7.14,10.54 7.14,10.54 7.12,10.52 7.11,10.5 7.11,10.5 7.11,10.5 7.08,10.49 7.06,10.48 7.06,10.48 7.06,10.48 7.03,10.48 7.01,10.48 7.01,10.48 0.17,10.48 0.17,7.31 0.2,6.5 0.32,5.69 0.52,4.91 0.81,4.15 1.16,3.42 1.58,2.78 2.07,2.19 2.62,1.66 3.23,1.2 3.9,0.82 4.6,0.52 5.34,0.31 6.09,0.18 6.86,0.15 9.45,0.19 9.49,1.79 9.49,1.81 9.49,1.82 9.49,1.82 9.5,1.84 9.51,1.86 9.51,1.86 9.51,1.86 9.53,1.88 9.54,1.9 9.54,1.9 9.55,1.9 9.57,1.91 9.59,1.92 9.59,1.92
  pour Route2: 207 corners
HAPTIC_EN
  Top 0.15: U1.P$U1 43.87,14.48 44.98,13.37 44.98,6.06 44.16,5.23 27.35,5.23 27.08,4.97 26.71,4.97 26.44,5.24 26.13,5.24 25.96,5.41 25.96,5.52 25.87,5.6 24.46,5.6 24.41,5.56 23.15,5.56 23.04,5.66 5.3,5.66 IC2.A1
IMU_INT1  (via drill 0.2)
  Top 0.15: U1.P$N1 40.32,13.48 40.75,13.91 43.62,13.91 44.41,13.12 44.41,6.34 43.88,5.8 26.55,5.8 v26.39,5.64 | v26.42,8.24 25.78,8.24 IC3.5
  Bottom 0.15: v26.39,5.64 26.39,8.21 v26.42,8.24
IMU_INT2  (via drill 0.2)
  Top 0.15: v40.31,14.08 40.52,14.08 40.63,14.2 43.74,14.2 44.69,13.25 44.69,6.17 44.04,5.52 27.09,5.52 v26.92,5.35 | v26.96,8.24 26.43,8.76 IC3.6
  Bottom 0.15: U1.P$P2 39.96,13.73 v40.31,14.08 | v26.92,5.35 26.92,8.2 v26.96,8.24
  other vias: 39.07,13.73
LX1
  Top 0.254: 3.99,28.12 IC9.B3 IC9.B2
  Top 0.3: 3.99,28.12 3.42,27.55 L7.1
LX2
  Top 0.254: 4.18,28.92 IC9.D3 IC9.D2
  Top 0.3: 4.18,28.92 3.49,29.61 L7.2
MOSI  (via drill 0.2)
  Top 0.15: J1.14 11.03,16.75 12.75,18.47 14.12,18.47 15.38,19.73 16.47,19.73 17.16,20.42 | 17.16,20.42 | 17.16,20.42 18.51,20.42 19.58,21.49 23.16,21.49 23.94,20.71 25.32,20.71 25.75,20.28 25.75,19.59 25.87,19.47 26.08,19.47 26.74,18.8 26.74,16.11 27.58,15.27 30.85,15.27 v30.87,15.3
  Bottom 0.15: v30.87,15.3 31.11,15.06 31.11,14.86 31.64,14.33 31.64,11.05 33.59,9.1 35.72,9.1 36.32,9.7 U1.P$B13
  other vias: 36.32,10.48
N$1
  Top 0.15: R9.2 10.31,32.26 IC1.D1
N$2
  Top 0.15: J4.A5 24.25,30.25 25.7,31.7 27.95,31.7 28.43,31.23 R1_USB.2
N$3
  Top 0.15: C1-EP-DR1.2 19.39,8.42 D5.2 18.5,8.53 18.29,8.74 18.29,11.21 18.59,11.52 19.53,11.52 19.92,11.91 L4.1 20.63,14.91 21.95,16.23 22.65,16.23 Q3.3
N$4
  Top 0.15: IC3.1 24.23,6.37 R3.2
N$5
  Top 0.3: J1.4 11.84,21.75 12.02,21.94 12.02,22.18 12.32,22.48 EPD_C2.1
N$6
  Top 0.3: J1.5 11.98,21.25 12.21,21.47 EPD_C1.1
N$7
  Top 0.15: J1.24 11.28,11.75 11.99,11.05 11.99,10.68 12.29,10.38 EPD_C12.1
N$8
  Top 0.15: IC9.D1 5.61,28.92 6.1,28.43 R4.2
N$9
  Top 0.3: J1.22 11.82,12.75 12.17,12.4 EPD_C10.1
N$10
  Top 0.15: IC9.E1 5.81,29.32 5.95,29.18 R2.2
N$11
  Top 0.3: J1.20 11.57,13.75 12.22,14.4 EPD_C8.1
N$12
  Top 0.3: J1.19 11.45,14.25 11.91,14.71 11.91,15.11 12.2,15.4 EPD_C7.1
N$13
  Top 0.3: J1.18 11.26,14.75 11.44,14.93 11.44,15.68 12.16,16.4 EPD_C6.1
N$14
  Top 0.15: U1.P$N24 32.77,13.48 32.51,13.75 C9.1
N$15
  Top 0.15: U1.P$H23 33.41,12.07 32.72,12.07 32.34,12.45 C3.1 L1.1
N$16  (via drill 0.2 pad 0.5)
  Top 0.15: L1.2 28.75,13.27 v28.6,13.12 28.47,12.99 C4.1 C22.1 | v30.8,18.79 31.64,19.63 35.43,19.63 35.8,20.01 v36.21,20.01 | v39.55,20.16 43.97,20.16 ANT1.1
  Bottom 0.15: v28.6,13.12 28.6,13.38 29.4,14.18 29.4,14.42 28.82,15 28.82,16.85 28.69,16.97 28.69,17.63 29.07,18 30.02,18 v30.8,18.79 | v36.21,20.01 36.36,20.16 v39.55,20.16
N$17
  Top 0.15: U1.P$A23 33.57,8.61 33.47,8.51 C2.1 32.47,8.05 32.47,7.61 32.35,7.49 X1.3
N$18
  Top 0.15: U1.P$B24 32.76,10.48 32.49,10.74 31.71,10.74 31.51,10.55 C1.1 31.51,9.88 31.36,9.73 30.68,9.73 30.56,9.61 X1.1
N$19
  Top 0.15: U1.P$D23 33.37,11.03 32.45,11.03 32.22,11.27 C11.2
N$20
  Top 0.15: U1.P$A18 35.07,9.61 35.28,9.4 35.28,8.53 C13.2
N$21
  Top 0.15: U1.P$B3 39.04,10.26 L2.2
N$22
  Top 0.15: L3.2 38.15,8.22 38.53,7.84 L2.1
N$23  (via drill 0.2)
  Top 0.15: U1.P$B5 38.32,9.71 37.86,9.25 L3.1 37.78,8.66 C16.1 36.75,8.44 v36.26,8.44 | U1.P$E24 32.48,11.48 31.8,12.16 30.36,12.16 C10.2 29.79,10.56 C15.1 30.38,10.53 v30.75,10.9
  Bottom 0.15: v36.26,8.44 33.42,8.44 30.96,10.9 v30.75,10.9
N$24
  Top 0.15: U1.P$C1 39.61,10.98 40.4,10.19 40.4,9.62 40.54,9.48 C5.2
N$25
  Top 0.15: U1.P$D2 39.13,11.29 39.71,11.29 39.94,11.06 40.49,11.06 C17.2 40.53,10.55 41.23,9.85 X2.2
N$26
  Top 0.15: U1.P$F2 39.14,11.66 39.73,11.66 39.97,11.89 C18.2 40.53,12.12 40.76,12.35 X2.1
N$27
  Top 0.15: D3.1 21.78,10.76 D4.2 21.96,10.2 21.73,9.97 21.62,9.97 C1-EP-DR1.1
N$28
  Top 0.15: J4.B5 21.25,29.87 19.8,31.32 R2_USB.1
N$29
  Top 0.15: IC2.A2 5.48,4.92 5.78,4.62 C32.1
N$30
  Top 0.15: R1_EP_DR.1 22.55,19.86 22.71,20.02 24.21,20.02 24.45,19.79 R_TYPE_SEL.2 24.45,18.69 25.17,17.96 SJ1.2
OUT+
  Top 0.15: IC2.A3 5.06,2.78 TP_OP.TP
OUT-
  Top 0.15: IC2.C3 4.06,4.07 3.65,3.66 TP_ON.TP
P0.13  (via drill 0.2, 0.2 pad 0.5)
  Top 0.15: C30.1 30.79,3.37 31.2,3.79 R5.1 31.74,4.43 v31.81,4.36 31.9,4.27 SW_UP.2 | v36.38,4.72 36.77,4.72 36.99,4.95 44.3,4.95 45.27,5.92 45.27,13.48 43.82,14.93 v43.82,15.26
  Bottom 0.15: v31.81,4.36 32.18,4.72 v36.38,4.72 | v43.82,15.26 42.92,16.16 42.23,16.16 42.11,16.28 37.77,16.28 U1.P$AD8
  other vias: 37.57,16.48
P0.14  (via drill 0.2, 0.2 pad 0.5)
  Top 0.15: C31.1 19.54,3.36 19.9,3.72 R8.1 20.62,4.43 20.77,4.27 SW_ENT.2 21.6,5.11 v21.69,5.2 | v43.3,7.83 43.57,7.56 43.57,7.01 43.24,6.68 27.63,6.68 27.35,6.96 27.35,8.62 27.13,8.84 27.13,10.21 26.8,10.54 26.48,10.54 26.16,10.86 26.16,11.34 25.98,11.51 24.98,11.51 24.77,11.31 24.77,11.16 24.52,10.91 24.52,10.74 24.3,10.52 23.9,10.52 23.59,10.21 23.59,9.75 23.79,9.55 23.79,8.65 23.13,7.99 23.13,7.56 22.89,7.32 22.68,7.32 v22.11,6.75
  Bottom 0.15: v21.69,5.2 22.11,5.62 v22.11,6.75 | v43.3,7.83 43.3,7.86 44.08,8.64 44.08,14.22 43.35,14.96 43.35,15.18 42.66,15.86 42.13,15.86 42.01,15.98 U1.P$AC9
  other vias: 37.32,15.98
P1.01  (via drill 0.2)
  Top 0.15: Q1.1 20.45,18.63 R_PWR_EPD.1 21.35,19.38 21.65,19.68 21.65,19.89 22.07,20.3 25.04,20.3 25.43,19.92 25.43,19.38 25.66,19.15 25.99,19.15 26.47,18.68 26.47,15.97 27.56,14.88 31.7,14.88 32.07,15.24 v32.34,15.24
  Bottom 0.15: U1.P$Y23 v32.35,15.23 v32.34,15.24
  other vias: 33.57,15.23
P1.02  (via drill 0.2 pad 0.5)
  Top 0.15: C29.1 8.4,3.87 8.66,3.87 8.9,4.11 R7.1 9.49,4.43 v9.63,4.29 9.67,4.25 10.57,4.25 SW_DN.2 | v9.65,6.75 10,6.75 10.2,6.55 21.21,6.55 23.5,8.83 23.5,9.45 23.28,9.66 23.28,10.33 23.8,10.85 24.2,10.85 24.2,11.15 24.85,11.8 26.84,11.8 27.49,12.45 27.49,13.28 28.02,13.81 30.52,13.81 v30.56,13.85 | v32.13,14.6 32.35,14.6 32.73,14.98 U1.P$W24
  Bottom 0.15: v9.63,4.29 9.63,6.73 v9.65,6.75 | v30.56,13.85 30.4,13.85 29.12,15.13 29.12,16.97 28.98,17.12 28.98,17.48 29.21,17.71 29.57,17.71 29.8,17.49 29.8,17.01 29.72,16.93 29.72,16.2 29.87,16.05 30.07,16.05 30.44,15.69 31.05,15.69 31.4,15.33 31.4,14.97 31.77,14.6 v32.13,14.6
P$AC5
  Top 0.254: 38.44,16.1 39.37,16.1
  Top 0.3: U1.P$AC5 38.44,16.1 | 39.37,16.1 40.26,16.99 C20.1
PMIC_INT  (via drill 0.2)
  Top 0.15: v40.16,14.91 40.31,14.76 42.39,14.76 43.55,15.92 43.55,17.86 42.84,18.57 40.27,18.57 39.02,19.82 39.02,22.01 37.78,23.25 37.78,24.98 38.73,25.93 38.73,29.6 v38.72,29.62 | v35.7,34.36 35.32,34.36 35.05,34.63 28.63,34.63 28.16,34.15 28.16,32.95 27.75,32.55 17.65,32.55 17.3,32.9 17.3,33.94 17.3,33.95 17.3,34.37 v17.22,34.45 | v10.37,34.33 10.37,33.52 IC1.A1
  Bottom 0.15: U1.P$T2 39.75,14.91 v40.16,14.91 | v38.72,29.62 38.72,34.06 38.16,34.62 35.96,34.62 v35.7,34.36 | v17.22,34.45 10.49,34.45 v10.37,34.33
  other vias: 39.07,14.23
PREVGH
  Top 0.3: EPD_C9.1 12.5,13.25 J1.21 9.9,13.25 9.47,12.82 9.47,11.27 10.06,10.67 10.8,10.67 11.43,10.05 11.43,9.77 12.08,9.12 14.22,9.12 14.81,8.53 D5.1
PREVGL
  Top 0.3: EPD_C11.1 12.22,11.4 11.37,12.25 J1.23 10.11,12.25 9.93,12.08 9.93,11.43 10.21,11.15 11.01,11.15 11.97,10.19 11.97,9.88 12.21,9.64 14.14,9.64 14.33,9.82 14.33,10.32 14.77,10.76 D3.2
RESE  (via drill 0.2 pad 0.5)
  Top 0.15: R1_EP_DR.2 22.02,19.5 Q3.2 v21.28,18.3 | J1.3 11.41,22.25 v11.5,22.33
  Bottom 0.15: v11.5,22.33 16.57,22.33 19.33,19.57 20.42,19.57 21.28,18.71 v21.28,18.3
RESET  (via drill 0.2, 0.2 pad 0.5)
  Top 0.15: J2.6 36.94,28.26 36.94,28.53 39.44,31.04 39.78,31.04 | 39.78,31.04 39.96,31.04 | 39.96,31.04 40.14,31.04 | TP_RESET\.TP 40.97,31.8 40.21,31.04 40.14,31.04 | v34.94,21.63 35.21,21.63 35.41,21.43 37.93,21.43 v38.12,21.62 | v39.48,21.76 39.48,21.95 38.06,23.37 38.06,24.85 39.01,25.8 39.01,29.3 39.16,29.45 39.16,30.01 39.3,30.14 39.68,30.14 39.96,30.42 39.96,30.86 | 39.96,30.86 39.96,31.04 | 40.14,31.04 39.96,30.86 | 39.96,30.86 39.78,31.03 39.78,31.04
  Bottom 0.15: U1.P$AC13 36.1,15.98 35.75,16.33 35.75,16.82 34.72,17.85 34.42,17.85 34.11,18.16 34.11,21.01 34.73,21.63 v34.94,21.63 | v38.12,21.62 39.34,21.62 v39.48,21.76
  other vias: 36.32,15.98
SCK  (via drill 0.2)
  Top 0.15: J1.13 11.13,17.25 12.63,18.75 14.01,18.75 15.28,20.02 16.37,20.02 17.06,20.71 | 17.06,20.71 | 17.06,20.71 18.41,20.71 19.47,21.77 23.28,21.77 24.06,21 25.43,21 26.04,20.38 26.04,19.91 27.03,18.92 27.03,16.21 27.57,15.67 v29.82,15.67 | v36.36,9.18 36.36,9.34 36.57,9.55 U1.P$A12
  Bottom 0.15: v29.82,15.67 29.86,15.67 31.36,14.18 31.36,10.94 33.48,8.81 36,8.81 v36.36,9.18
SCL  (via drill 0.2, 0.2 pad 0.5)
  Top 0.15: R17.2 v4.84,30.59 4.09,31.34 TP_SCL.TP | 7.93,28.43 R4.1 7.01,27.93 v6.91,27.83 | 7.93,28.43 8.06,28.3 | 8.06,28.3 v9.09,27.26 9.31,27.04 U3.7 | IC2.C1 v1.49,5.42 0.39,6.52 0.39,9.72 0.88,10.2 8.26,10.2 8.7,10.64 8.7,11.73 7.52,12.91 7.52,22.46 8.8,23.74 v8.8,26.11 v8.79,26.12 | IC1.B1 10.13,33.11 9.19,32.16 9.19,29.69 8.06,28.56 | 8.06,28.56 7.93,28.43 | 8.06,28.3 8.06,28.56 | v40.92,13.53 41.02,13.63 43.5,13.63 44.13,12.99 44.13,6.49 43.74,6.1 25.18,6.1 v25.08,5.99 | v24.74,8.25 24.73,8.26 IC3.12 23.86,8.26 23.47,7.86 23.47,7.18 22.52,6.24 5.43,6.24 5.01,6.65 4.94,6.65 4.85,6.74 4.4,6.74 4.29,6.64 1.71,6.64 v1.5,6.85
  Bottom 0.15: v8.79,26.12 8.79,26.96 v9.09,27.26 | v1.49,5.42 v1.49,6.84 v1.5,6.85 | v4.84,30.59 5.24,30.19 6.44,30.19 6.46,30.18 6.46,29.86 7.18,29.14 7.18,28.11 v6.91,27.84 v6.91,27.83 | U1.P$M2 40.62,13.23 v40.92,13.53 | v25.08,5.99 24.74,6.33 v24.74,8.25
  other vias: 39.07,13.23
SDA  (via drill 0.2, 0.2 pad 0.5)
  Top 0.15: R18.2 v5.48,32.1 5.48,33.47 TP_SDA.TP | R2.1 7.38,29.18 v7.64,28.92 | v7.64,27.94 9.04,26.54 9.23,26.54 | 9.23,26.54 9.42,26.54 | 9.42,26.54 9.62,26.54 | 9.62,26.54 U3.8 | 9.42,26.34 9.42,23.96 7.83,22.37 7.83,13.02 8.99,11.86 8.99,10.53 8.37,9.91 0.98,9.91 0.68,9.61 0.68,6.63 0.97,6.34 v4.56,6.34 4.91,6.34 5.31,5.94 23.2,5.94 23.21,5.94 23.28,5.88 24.39,5.88 24.72,6.2 | 9.42,26.34 9.42,26.54 | 9.62,26.54 9.42,26.34 | 9.42,26.34 9.23,26.53 9.23,26.54 | IC1.C1 10.14,32.71 9.48,32.05 9.48,29.34 v9.07,28.92 | 24.72,6.2 24.72,6.38 | 24.72,6.38 24.72,6.57 | 24.72,6.57 24.72,7.72 IC3.2 | U1.P$L1 41.01,12.98 41.38,13.35 43.38,13.35 43.85,12.87 43.85,6.76 43.48,6.38 24.91,6.38 | 24.89,6.38 24.72,6.38 | 24.91,6.38 24.72,6.57 | 24.91,6.38 24.89,6.38 | 24.89,6.38 24.72,6.2
  Bottom 0.15: v7.64,27.94 7.64,28.61 | v7.64,27.94 | v7.64,27.94 | v9.07,28.92 7.95,28.92 | 7.64,28.61 7.8,28.77 | 7.8,28.77 7.95,28.92 | 7.95,28.92 | 7.95,28.92 v7.64,28.92 | 7.64,28.61 v7.64,28.92 | v7.64,28.92 7.79,28.77 7.8,28.77 | v5.48,32.1 5.48,31.69 6.74,30.42 6.74,30 7.64,29.1 | 7.64,29.1 v7.64,28.92 | 7.64,29.1 7.82,28.92 7.95,28.92 | IC2.B2 v4.56,6.34
  other vias: 4.56,4.92
SWDCLK  (via drill 0.2)
  Top 0.15: J2.4 34.39,28.79 34.39,30.41 34.72,30.74 | 34.72,30.74 34.86,30.88 | 34.86,30.88 35.01,31.03 | 35.01,31.03 35.33,31.35 40,31.35 41.81,33.16 43.01,33.16 44.06,32.12 TP_SWDCLK.TP | U1.P$AA24 32.7,15.48 32.34,15.85 v32.23,15.85 | v30.8,28.79 30.8,30.83 31.75,31.78 33.48,31.78 v33.75,32.05 | v34.48,31.26 34.72,31.03 | 34.72,31.03 34.86,30.89 34.86,30.88 | 34.72,31.03 35.01,31.03 | 34.72,31.03 34.72,30.74
  Bottom 0.15: v32.23,15.85 32.27,15.89 32.27,19.44 30.89,20.82 30.89,28.01 30.8,28.1 v30.8,28.79 | v33.75,32.05 34.48,31.32 v34.48,31.26
SWDIO  (via drill 0.2)
  Top 0.15: J2.2 33.48,27.88 33.08,28.29 32.06,28.29 31.75,28.6 | 31.75,28.6 31.61,28.74 | 31.47,28.88 31.18,29.17 31.18,30.81 31.86,31.49 33.86,31.49 34.26,31.89 37.67,31.89 38.11,32.34 38.11,32.58 38.64,33.11 TP_SWDIO.TP | U1.P$AC24 32.83,16.22 v32.83,16.59 | v31.28,28.21 31.28,28.4 31.48,28.6 | 31.48,28.6 31.75,28.6 | 31.48,28.6 31.47,28.6 31.48,28.6 | 31.61,28.74 31.48,28.6 | 31.48,28.6 31.47,28.62 31.47,28.88 | 31.47,28.88 31.61,28.74
  Bottom 0.15: v32.83,16.59 32.58,16.84 32.58,19.53 31.21,20.91 31.21,28.14 v31.28,28.21
SWO  (via drill 0.2 pad 0.5)
  Top 0.15: U1.P$AD22 34.14,16.48 34.77,17.11 34.77,17.3 34.26,17.81 v33.8,17.81 | v34.05,21.64 33.85,21.45 TP_SWO.TP
  Bottom 0.15: v33.8,17.81 33.8,21.39 v34.05,21.64
VBAT
  Top 0.2: 12.47,31.2 C37.1 12.97,30.8
  Top 0.254: IC1.C2 11.33,32.71 12.14,31.91 12.14,31.53 12.47,31.2 | 12.97,30.8 12.98,30.8 | 15.26,27.21 15.23,27.19 C27.1 13.47,27.19 13.46,27.19
  Top 0.3: 13.46,27.19 13.31,27.04 U3.2 U3.3 13.15,27.54 13.33,27.71 13.33,28.29 12.98,28.64 12.98,30.8 12.58,31.2 12.47,31.2 | 16.21,28.16 TP_VBAT.TP | 16.21,28.16 | 16.21,28.16 15.26,27.21
VBUS
  Top 0.254: IC1.A2 11.21,33.96 12.5,33.96 12.74,33.96 | U1.P$AD2 39.07,16.85 | 13.01,33.44 13.01,33.7 | 13.01,33.7 C38.1 12.74,33.96 | 12.74,33.96 13.01,33.7 | 18.76,27.36 18.77,27.34 C42.1 19.4,27.36 20.25,27.36
  Top 0.3: J4.A9_B4 20.6,28.1 20.3,27.8 C43.1 | 20.25,27.36 C43.1 | 39.07,16.85 38.66,17.26 C21.1 38.66,21.86 37.59,22.93 32.23,22.93 31.14,24.02 31.14,26.66 29.6,28.2 29.6,30.32 29.28,30.64 28.23,30.64 27.84,31.03 26.9,31.03 26.65,30.78 25.56,30.78 25.13,30.35 25.13,29.81 25.4,29.55 J4.A4_B9 25.4,26.71 24.39,25.7 23.3,25.7 | 18.76,27.36 17.63,28.48 17.63,29.27 15.77,31.14 15.77,32.81 15.28,33.3 13.15,33.3 13.01,33.44 | D2.5 22.96,25.38 | 22.98,25.7 22.66,25.7 | 22.98,25.7 23.3,25.7 | C43.1 20.69,27.3 21.18,26.82 21.18,26.23 21.72,25.69 22.65,25.69 22.66,25.7 | 22.98,25.7 22.98,25.39 | 22.98,25.39 22.96,25.38 | 23.3,25.7 22.99,25.39 22.98,25.39 | 22.66,25.7 22.66,25.68 22.96,25.38
VREG  (via drill 0.3 pad 0.7)
  Top 0.15: IC9.A2 | IC9.A2 IC9.A1 | IC9.A2 IC9.A3
  Top 0.254: C23.2 3.32,26.08 | IC1.B2 11.58,33.11 | 4.46,27.29 IC9.A3 IC9.A2 IC9.A1
  Top 0.3: 3.32,26.08 C24.2 | 12.12,32.57 11.58,33.11 11.95,33.11 11.97,33.09 | C24.2 v5.47,26.07 7.03,26.07 TP_VREG.TP | 4.46,27.29 4.57,27.18 C24.2 | v11.97,33.26 11.97,33.09 | 12.12,32.94 12.12,32.57 | 12.12,32.57 12.16,32.53 C39.1 12.53,32.53 12.12,32.94 | 12.12,32.94 11.97,33.09
  Bottom 0.3: v5.47,26.07 5.47,26.36 6.33,27.21 7.73,27.21 8.34,27.82 8.34,27.98 8.68,28.33 9.26,28.33 9.68,28.76 9.68,31.3 11.65,33.26 v11.97,33.26
(copper drawn outside any net)
  shapes: Bottom area x2, Route15 area x1, Route2 area x1, Top area x2